# Altium schematic sheet chan.SchDoc
size A
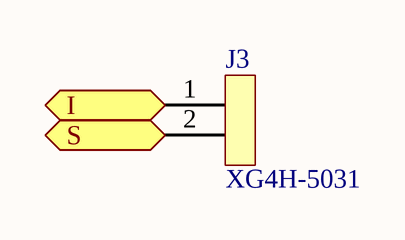
[diagram p0: chan.SchDoc]

## Parts
J3  XG4H-5031  [SIL2]

## Ports
I, S

## Nets
I: J3.1 ; port I
S: J3.2 ; port S

## Library data of the parts
J3 = XG4H-5031: Fencepost 2x1 0.1"